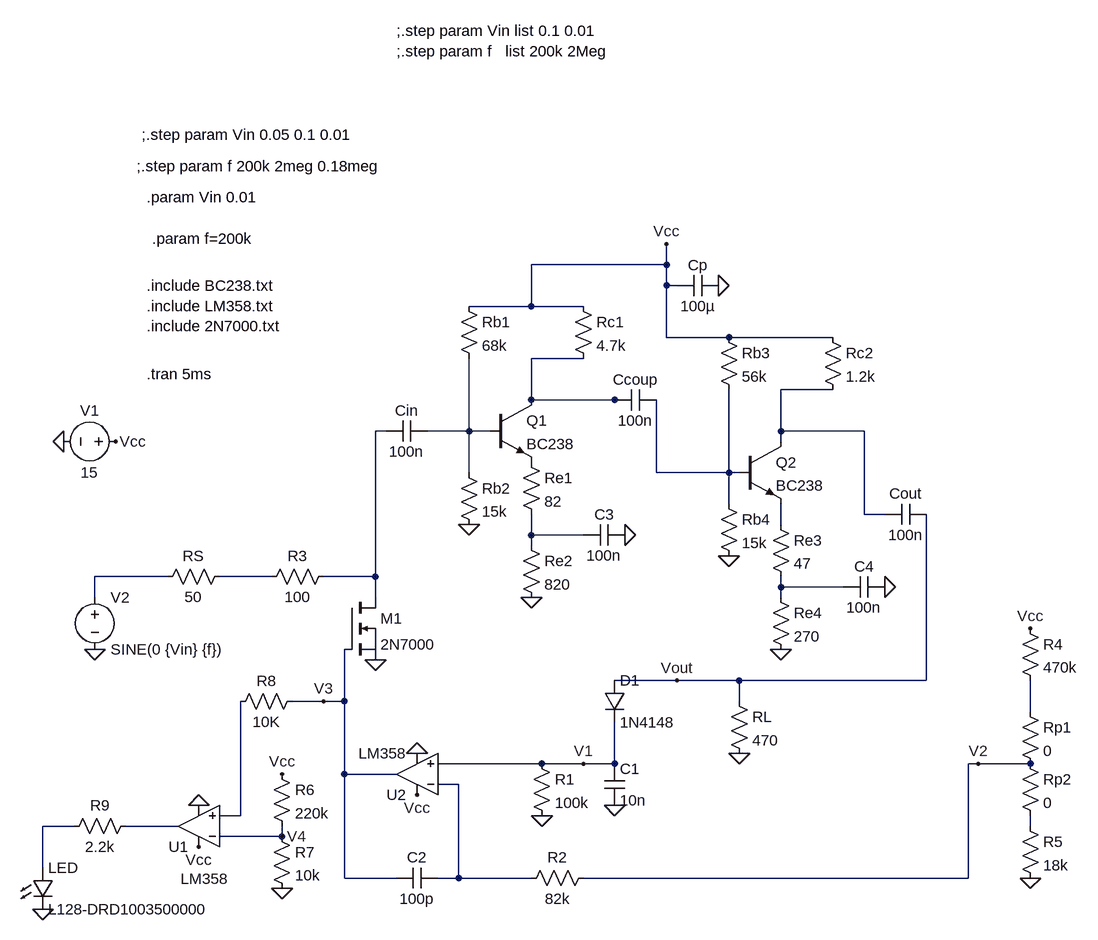
[diagram p0: schematic Akbay.asc]
Akbay.asc, the LTspice schematic file:
Version 4
SHEET 1 2932 680
WIRE 896 -752 896 -784
WIRE 896 -752 688 -752
WIRE 896 -720 896 -752
WIRE 912 -720 896 -720
WIRE 688 -688 688 -752
WIRE 688 -688 592 -688
WIRE 768 -688 688 -688
WIRE 896 -640 896 -720
WIRE 992 -640 896 -640
WIRE 1152 -640 992 -640
WIRE 768 -608 688 -608
WIRE 1152 -560 1072 -560
WIRE 688 -544 688 -608
WIRE 816 -544 688 -544
WIRE 832 -544 816 -544
WIRE 464 -496 448 -496
WIRE 592 -496 592 -608
WIRE 592 -496 528 -496
WIRE 624 -496 592 -496
WIRE 1072 -496 1072 -560
WIRE 1200 -496 1072 -496
WIRE 1072 -480 1072 -496
WIRE 592 -432 592 -496
WIRE 880 -432 880 -544
WIRE 992 -432 992 -560
WIRE 992 -432 880 -432
WIRE 1008 -432 992 -432
WIRE 992 -384 992 -432
WIRE 1200 -368 1200 -496
WIRE 1232 -368 1200 -368
WIRE 1072 -352 1072 -384
WIRE 688 -336 688 -368
WIRE 768 -336 688 -336
WIRE 688 -320 688 -336
WIRE 128 -272 16 -272
WIRE 288 -272 208 -272
WIRE 448 -272 448 -496
WIRE 448 -272 368 -272
WIRE 1072 -256 1072 -272
WIRE 1168 -256 1072 -256
WIRE 16 -240 16 -272
WIRE 448 -240 448 -272
WIRE 1072 -240 1072 -256
WIRE 912 -112 816 -112
WIRE 1008 -112 912 -112
WIRE 1296 -112 1296 -368
WIRE 1296 -112 1008 -112
WIRE 368 -80 320 -80
WIRE 400 -80 400 -160
WIRE 400 -80 368 -80
WIRE 1008 -80 1008 -112
WIRE 1456 -64 1456 -112
WIRE 704 16 544 16
WIRE 768 16 704 16
WIRE 816 16 816 -48
WIRE 816 16 768 16
WIRE 1376 16 1360 16
WIRE 1456 16 1376 16
WIRE 400 32 400 -80
WIRE 480 32 400 32
WIRE 576 48 544 48
WIRE 240 96 240 -80
WIRE 240 96 208 96
WIRE -16 112 -64 112
WIRE 144 112 64 112
WIRE 1456 112 1456 96
WIRE 304 128 304 112
WIRE 304 128 208 128
WIRE -64 176 -64 112
WIRE 400 192 400 32
WIRE 480 192 400 192
WIRE 576 192 576 48
WIRE 576 192 544 192
WIRE 688 192 576 192
WIRE 1360 192 1360 16
WIRE 1360 192 768 192
FLAG -64 240 0
FLAG 176 144 Vcc
FLAG 176 80 0
FLAG 304 32 Vcc
FLAG 304 208 0
FLAG 304 128 V4
FLAG 368 -80 V3
FLAG 512 64 Vcc
FLAG 512 0 0
FLAG 704 96 0
FLAG 816 80 0
FLAG 768 16 V1
FLAG 1456 -192 Vcc
FLAG 1456 192 0
FLAG 448 -144 0
FLAG 16 -160 0
FLAG 592 -352 0
FLAG 688 -240 0
FLAG 992 -304 0
FLAG 896 -784 Vcc
FLAG 976 -720 0
FLAG 1008 0 0
FLAG 912 -112 Vout
FLAG -32 -480 0
FLAG 48 -480 Vcc
FLAG 1376 16 V2
FLAG 832 -336 0
FLAG 1232 -256 0
FLAG 1072 -160 0
SYMBOL LED -80 176 R0
SYMATTR InstName LED
SYMATTR Value L128-DRD1003500000
SYMBOL res 80 96 R90
WINDOW 0 0 56 VBottom 2
WINDOW 3 32 56 VTop 2
SYMATTR InstName R9
SYMATTR Value 2.2k
SYMBOL OpAmps\\opamp2 176 176 R180
WINDOW 3 -46 -17 Left 2
SYMATTR Value LM358
SYMATTR InstName U1
SYMBOL res 288 112 R0
SYMATTR InstName R7
SYMATTR Value 10k
SYMBOL res 288 16 R0
SYMATTR InstName R6
SYMATTR Value 220k
SYMBOL res 336 -96 R90
WINDOW 0 0 56 VBottom 2
WINDOW 3 32 56 VTop 2
SYMATTR InstName R8
SYMATTR Value 10K
SYMBOL OpAmps\\opamp2 512 96 R180
SYMATTR InstName U2
SYMATTR Value LM358
SYMBOL cap 544 176 R90
WINDOW 0 0 32 VBottom 2
WINDOW 3 32 32 VTop 2
SYMATTR InstName C2
SYMATTR Value 100p
SYMBOL res 688 0 R0
SYMATTR InstName R1
SYMATTR Value 100k
SYMBOL cap 800 16 R0
SYMATTR InstName C1
SYMATTR Value 10n
SYMBOL diode 800 -112 R0
SYMATTR InstName D1
SYMATTR Value 1N4148
SYMBOL res 784 176 R90
WINDOW 0 0 56 VBottom 2
WINDOW 3 32 56 VTop 2
SYMATTR InstName R2
SYMATTR Value 82k
SYMBOL res 1440 -208 R0
SYMATTR InstName R4
SYMATTR Value 470k
SYMBOL res 1440 96 R0
SYMATTR InstName R5
SYMATTR Value 18k
SYMBOL res 1440 0 R0
SYMATTR InstName Rp2
SYMATTR Value 0
SYMBOL res 1440 -80 R0
SYMATTR InstName Rp1
SYMATTR Value 0
SYMBOL npn 624 -544 R0
SYMATTR InstName Q1
SYMATTR Value BC238
SYMBOL npn 1008 -480 R0
SYMATTR InstName Q2
SYMATTR Value BC238
SYMBOL res 384 -288 R90
WINDOW 0 0 56 VBottom 2
WINDOW 3 32 56 VTop 2
SYMATTR InstName R3
SYMATTR Value 100
SYMBOL res 224 -288 R90
WINDOW 0 0 56 VBottom 2
WINDOW 3 32 56 VTop 2
SYMATTR InstName RS
SYMATTR Value 50
SYMBOL voltage 16 -256 R0
WINDOW 123 0 0 Left 0
WINDOW 39 0 0 Left 0
SYMATTR InstName V2
SYMATTR Value SINE(0 {Vin} {f})
SYMBOL cap 528 -512 R90
WINDOW 0 0 32 VBottom 2
WINDOW 3 32 32 VTop 2
SYMATTR InstName Cin
SYMATTR Value 100n
SYMBOL res 576 -704 R0
SYMATTR InstName Rb1
SYMATTR Value 68k
SYMBOL res 576 -448 R0
SYMATTR InstName Rb2
SYMATTR Value 15k
SYMBOL res 752 -704 R0
SYMATTR InstName Rc1
SYMATTR Value 4.7k
SYMBOL res 672 -336 R0
SYMATTR InstName Re2
SYMATTR Value 820
SYMBOL cap 880 -560 R90
WINDOW 0 0 32 VBottom 2
WINDOW 3 32 32 VTop 2
SYMATTR InstName Ccoup
SYMATTR Value 100n
SYMBOL res 976 -656 R0
SYMATTR InstName Rb3
SYMATTR Value 56k
SYMBOL res 1136 -656 R0
SYMATTR InstName Rc2
SYMATTR Value 1.2k
SYMBOL res 976 -400 R0
SYMATTR InstName Rb4
SYMATTR Value 15k
SYMBOL res 1056 -368 R0
SYMATTR InstName Re3
SYMATTR Value 47
SYMBOL cap 1296 -384 R90
WINDOW 0 0 32 VBottom 2
WINDOW 3 32 32 VTop 2
SYMATTR InstName Cout
SYMATTR Value 100n
SYMBOL cap 976 -736 R90
WINDOW 0 0 32 VBottom 2
WINDOW 3 32 32 VTop 2
SYMATTR InstName Cp
SYMATTR Value 100µ
SYMBOL res 992 -96 R0
SYMATTR InstName RL
SYMATTR Value 470
SYMBOL voltage 64 -480 R90
WINDOW 0 -32 56 VBottom 2
WINDOW 3 32 56 VTop 2
SYMATTR InstName V1
SYMATTR Value 15
SYMBOL cap 768 -320 R270
WINDOW 0 32 32 VTop 2
WINDOW 3 0 32 VBottom 2
SYMATTR InstName C3
SYMATTR Value 100n
SYMBOL cap 1168 -240 R270
WINDOW 0 32 32 VTop 2
WINDOW 3 0 32 VBottom 2
SYMATTR InstName C4
SYMATTR Value 100n
SYMBOL res 672 -464 R0
SYMATTR InstName Re1
SYMATTR Value 82
SYMBOL res 1056 -256 R0
SYMATTR InstName Re4
SYMATTR Value 270
SYMBOL nmos 400 -240 R0
SYMATTR InstName M1
SYMATTR Value 2N7000
SYMATTR Prefix X
TEXT 96 -584 Left 2 !.tran 5ms
TEXT 96 -720 Left 2 !.include BC238.txt\n.include LM358.txt\n.include 2N7000.txt
TEXT 80 -904 Left 2 !;.step param f 200k 2meg 0.18meg
TEXT 96 -856 Left 2 !.param Vin 0.01
TEXT 88 -952 Left 2 !;.step param Vin 0.05 0.1 0.01
TEXT 104 -792 Left 2 !.param f=200k
TEXT 480 -1112 Left 2 !;.step param Vin list 0.1 0.01\n;.step param f   list 200k 2Meg

The netlist it stands for:
* Akbay.asc
D§LED N014 0 L128-DRD1003500000
R9 N015 N014 2.2k
XU1 N013 V4 Vcc 0 N015 LM358  ; pins In+ In- V+ V- OUT
R7 V4 0 10k
R6 Vcc V4 220k
R8 V3 N013 10K
XU2 V1 N012 Vcc 0 V3 LM358  ; pins In+ In- V+ V- OUT
C2 N012 V3 100p
R1 V1 0 100k
C1 V1 0 10n
D1 Vout V1 1N4148
R2 V2 N012 82k
R4 Vcc N011 470k
R5 N016 0 18k
Rp2 V2 N016 0
Rp1 N011 V2 0
Q1 N001 N004 P001 0 BC238
Q2 N002 N005 N006 0 BC238
R3 N003 N009 100
RS N009 N008 50
V2 N008 0 SINE(0 {Vin} {f})
Cin N004 N003 100n
Rb1 Vcc N004 68k
Rb2 N004 0 15k
Rc1 Vcc N001 4.7k
Re2 N007 0 820
Ccoup N005 N001 100n
Rb3 Vcc N005 56k
Rc2 Vcc N002 1.2k
Rb4 N005 0 15k
Re3 N006 N010 47
Cout Vout N002 100n
Cp 0 Vcc 100µ
RL Vout 0 470
V1 Vcc 0 15
C3 N007 0 100n
C4 N010 0 100n
Re1 P001 N007 82
Re4 N010 0 270
XM1 N003 V3 0 2N7000  ; pins D G S
.model D D
.lib standard.dio
.model NPN NPN
.model PNP PNP
.lib standard.bjt
.tran 5ms
.include BC238.txt
.include LM358.txt
.include 2N7000.txt
;.step param f 200k 2meg 0.18meg
.param Vin 0.01
;.step param Vin 0.05 0.1 0.01
.param f=200k
;.step param Vin list 0.1 0.01
;.step param f   list 200k 2Meg
.backanno
.end